# Altium schematic sheet Soket_Board_Shematic.SchDoc
size A
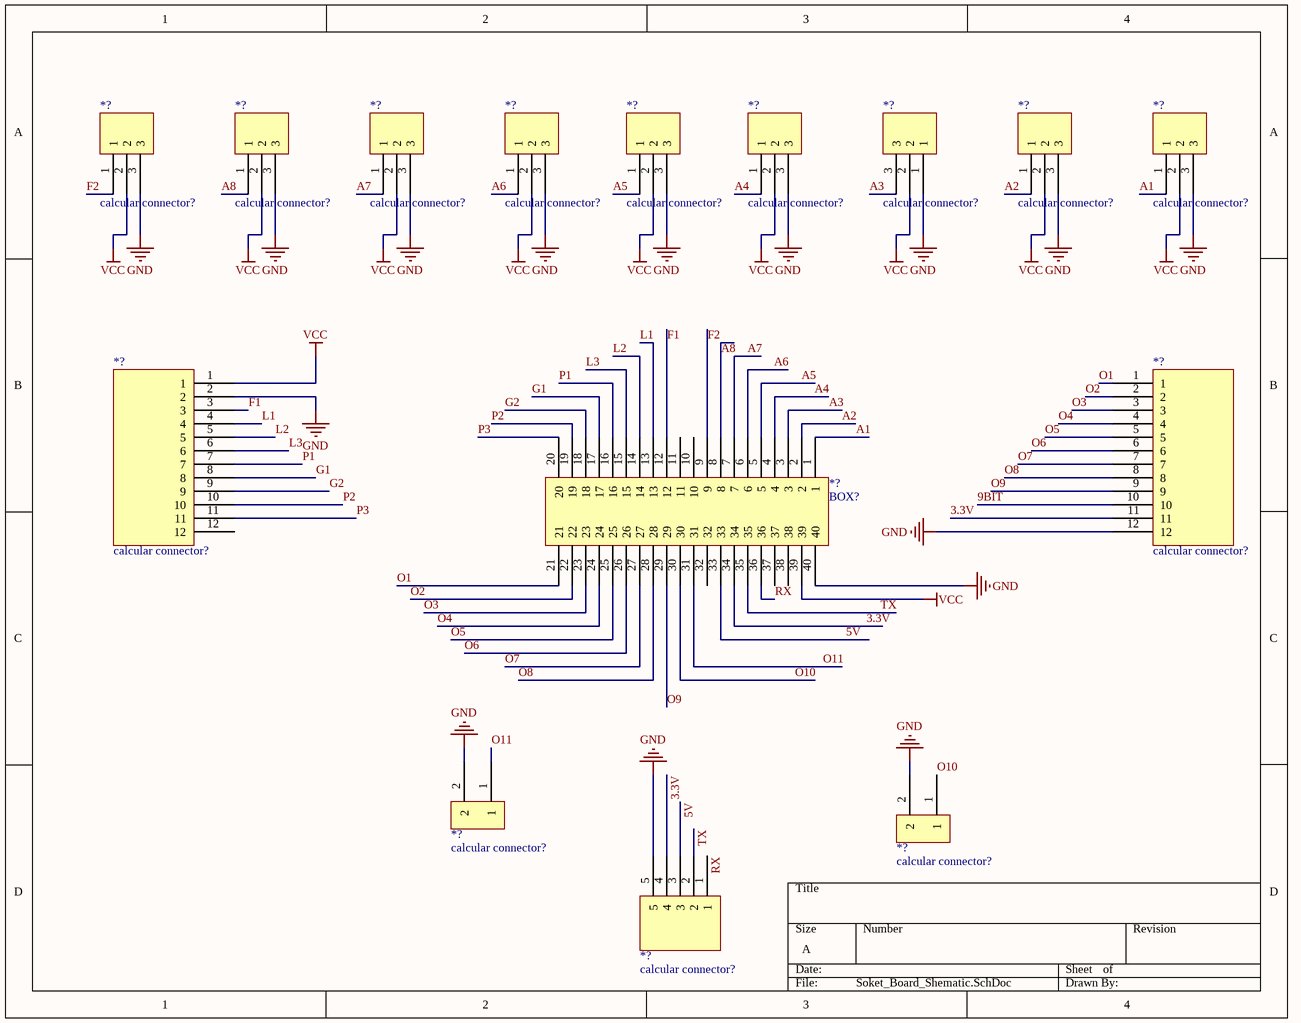
[diagram p0: Soket_Board_Shematic.SchDoc]

## Parts
(Parts that share a designator on the sheet are numbered #1, #2 ... from top to bottom, then left to right.)
*?#1  calcular connector?  [circular connector 3 pin small]
*?#2  calcular connector?  [circular connector 3 pin small]
*?#3  calcular connector?  [circular connector 3 pin small]
*?#4  calcular connector?  [circular connector 3 pin small]
*?#5  calcular connector?  [circular connector 3 pin small]
*?#6  calcular connector?  [circular connector 3 pin small]
*?#7  calcular connector?  [circular connector 3 pin small]
*?#8  calcular connector?  [circular connector 3 pin small]
*?#9  calcular connector?  [circular connector 3 pin small]
*?#10  BOX?  [BOX HEADER 2X20]
*?#11  calcular connector?  [circular canector 2 pin big]
*?#12  calcular connector?  [circular canector 2 pin big]
*?#13  calcular connector?  [PCBComponent_1]
*?#14  calcular connector?  [calculator connector 12 pin big]
*?#15  calcular connector?  [calculator connector 12 pin big]

## Nets
GND: *?#1.3 *?#2.3 *?#3.3 *?#4.3 *?#5.3 *?#6.3 *?#7.1 *?#8.3 *?#9.3 *?#10.40 *?#11.2 *?#12.2 *?#13.5 *?#14.2 *?#15.12
VCC: *?#1.2 *?#2.2 *?#3.2 *?#4.2 *?#5.2 *?#6.2 *?#7.2 *?#8.2 *?#9.2 *?#10.39 *?#14.1
3.3V: *?#10.34 *?#13.4 *?#15.11
5V: *?#10.33 *?#13.3
9BIT: *?#15.10
A1: *?#9.1 *?#10.1
A2: *?#8.1 *?#10.2
A3: *?#7.3 *?#10.3
A4: *?#6.1 *?#10.4
A5: *?#5.1 *?#10.5
A6: *?#4.1 *?#10.6
A7: *?#3.1 *?#10.7
A8: *?#2.1 *?#10.8
F1: *?#10.12 *?#14.3
F2: *?#1.1 *?#10.9
G1: *?#10.17 *?#14.8
G2: *?#10.18 *?#14.9
L1: *?#10.13 *?#14.4
L2: *?#10.14 *?#14.5
L3: *?#10.15 *?#14.6
O1: *?#10.21 *?#15.1
O2: *?#10.22 *?#15.2
O3: *?#10.23 *?#15.3
O4: *?#10.24 *?#15.4
O5: *?#10.25 *?#15.5
O6: *?#10.26 *?#15.6
O7: *?#10.27 *?#15.7
O8: *?#10.28 *?#15.8
O9: *?#10.29 *?#15.9
O10: *?#10.30 *?#12.1
O11: *?#10.31 *?#11.1
P1: *?#10.16 *?#14.7
P2: *?#10.19 *?#14.10
P3: *?#10.20 *?#14.11
RX: *?#10.36 *?#13.1
TX: *?#10.35 *?#13.2

Not connected (* = marked no-connect by the designer): *?#10 10 11 32 37 38; *?#14 12